# Altium schematic sheet Relays.SchDoc: RELAY
size A1; DocumentNumber: 5; SheetNumber: 5; SheetTotal: 5
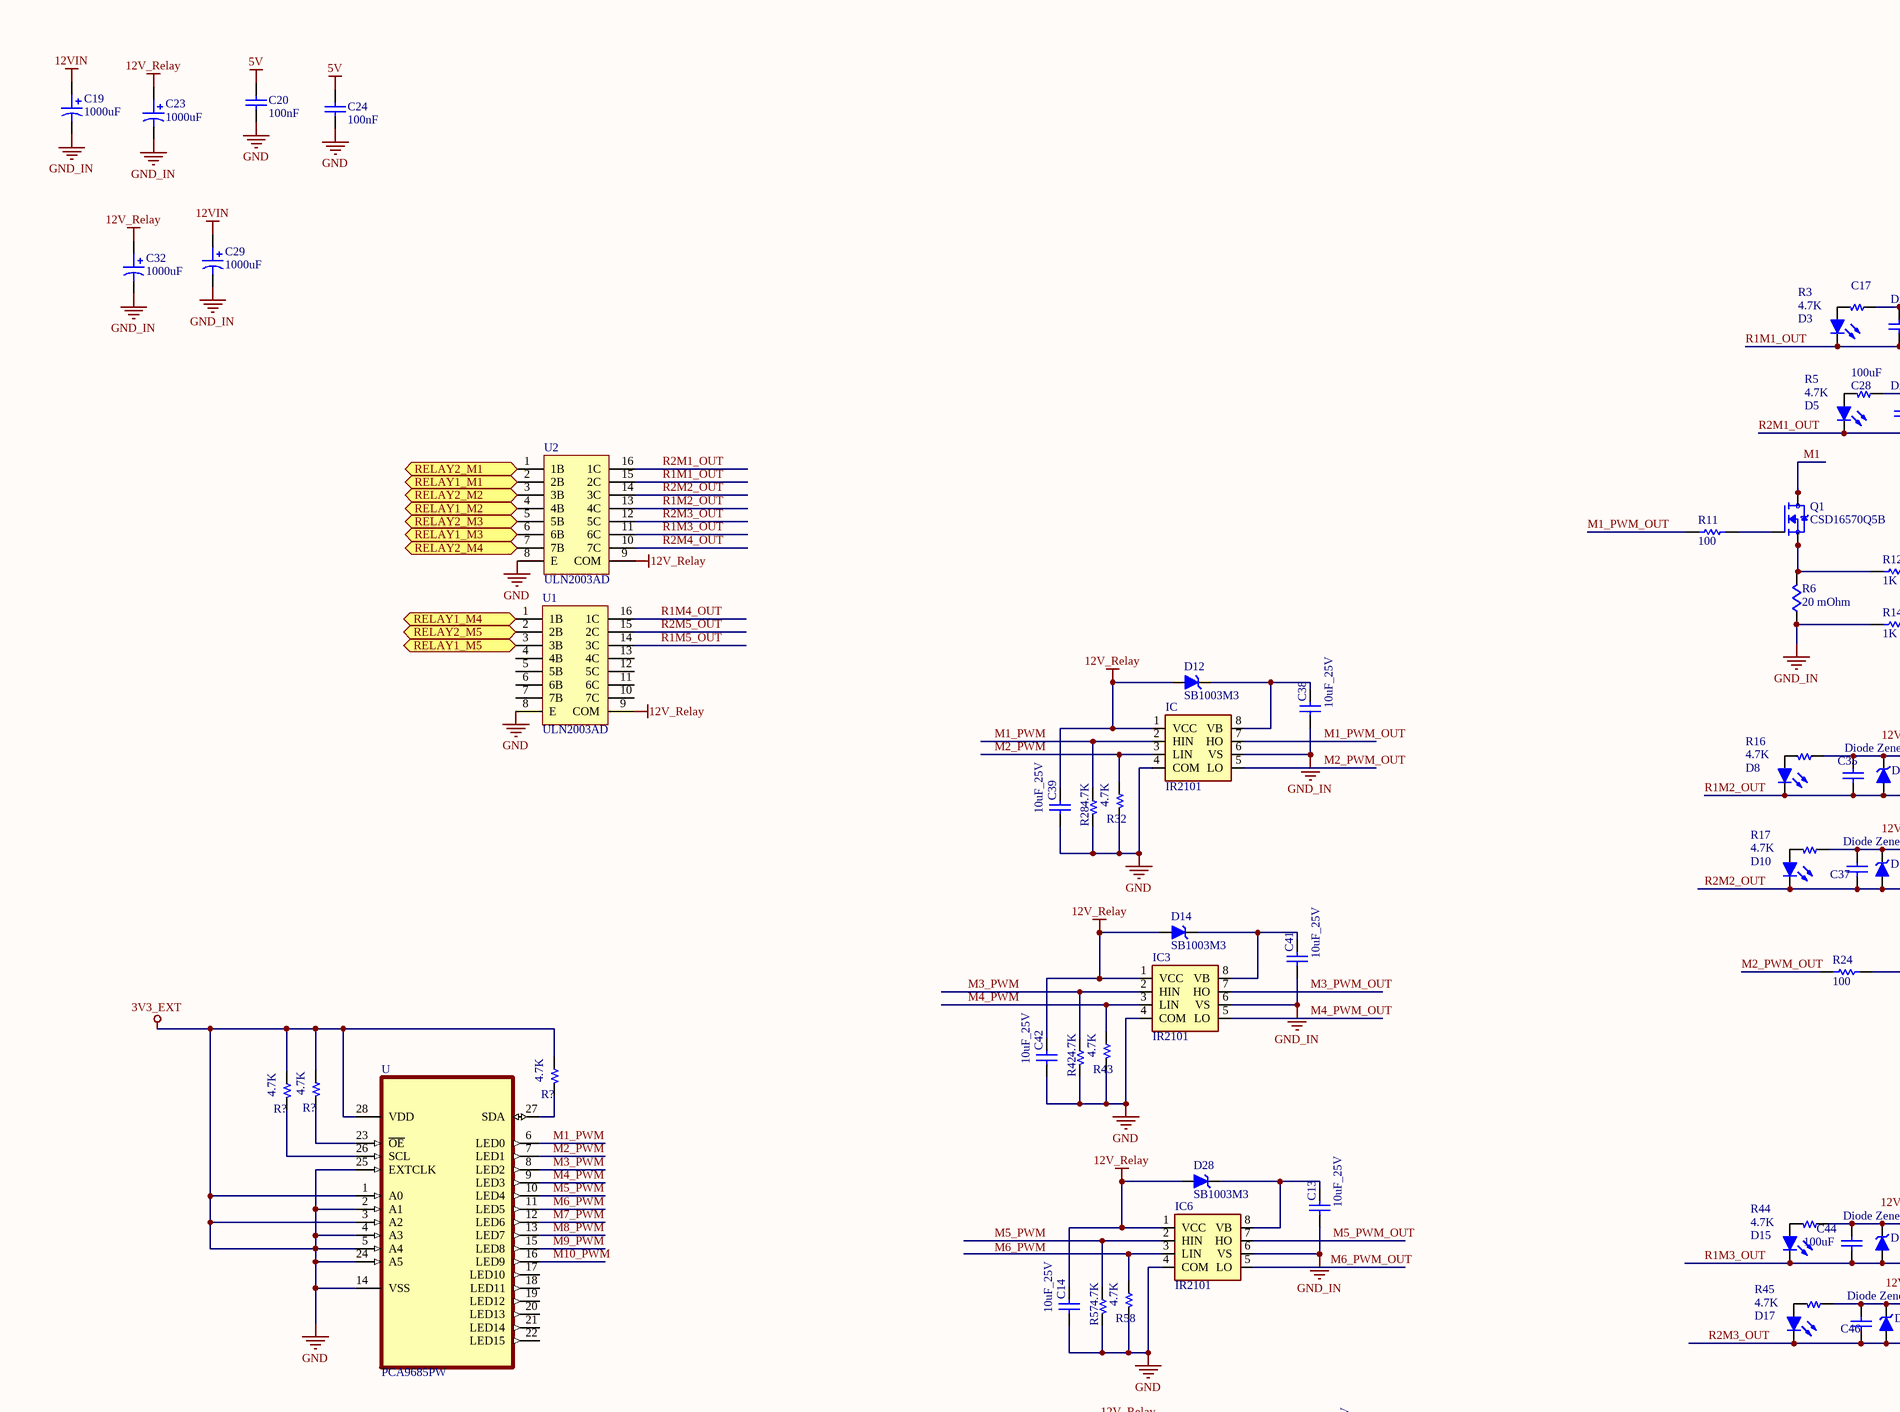
[diagram p0: Relays.SchDoc, top left]
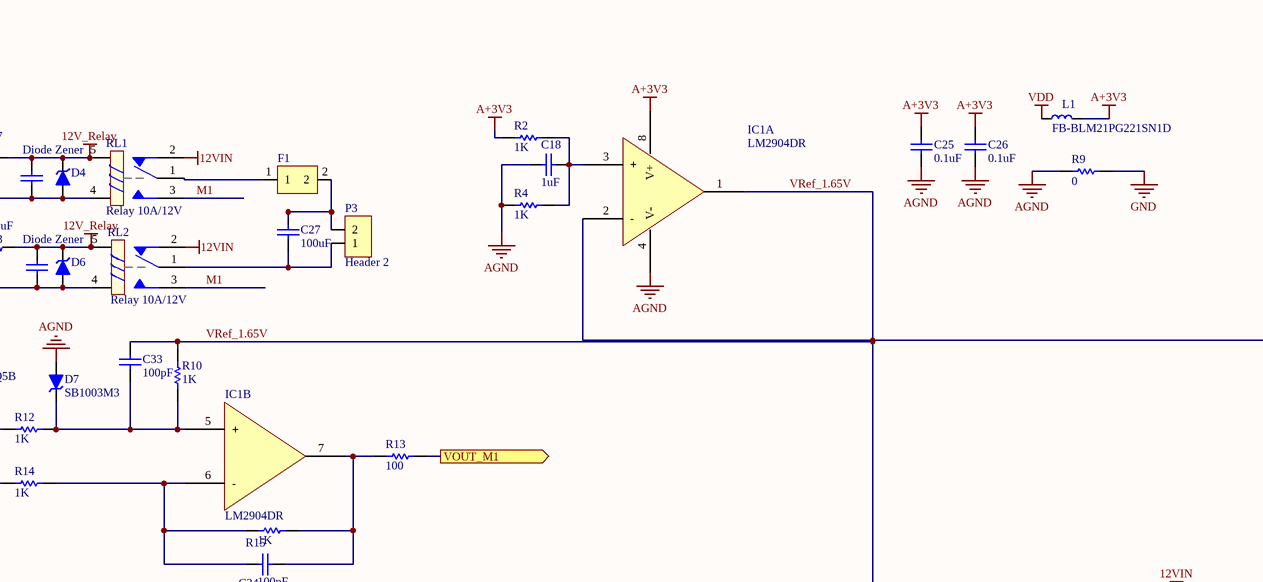
[diagram p1: Relays.SchDoc, top right]
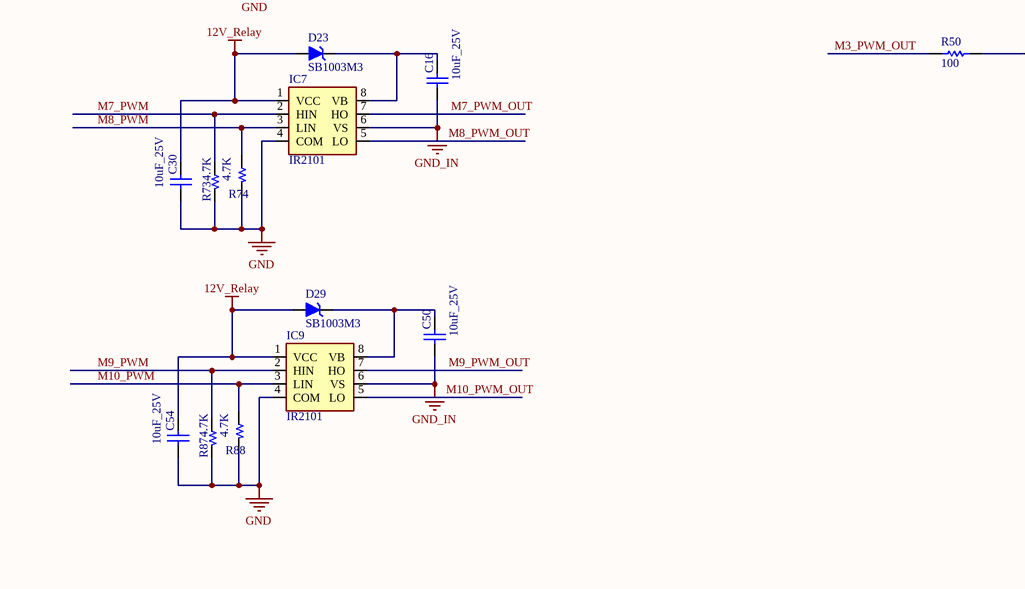
[diagram p2: Relays.SchDoc, bottom left]
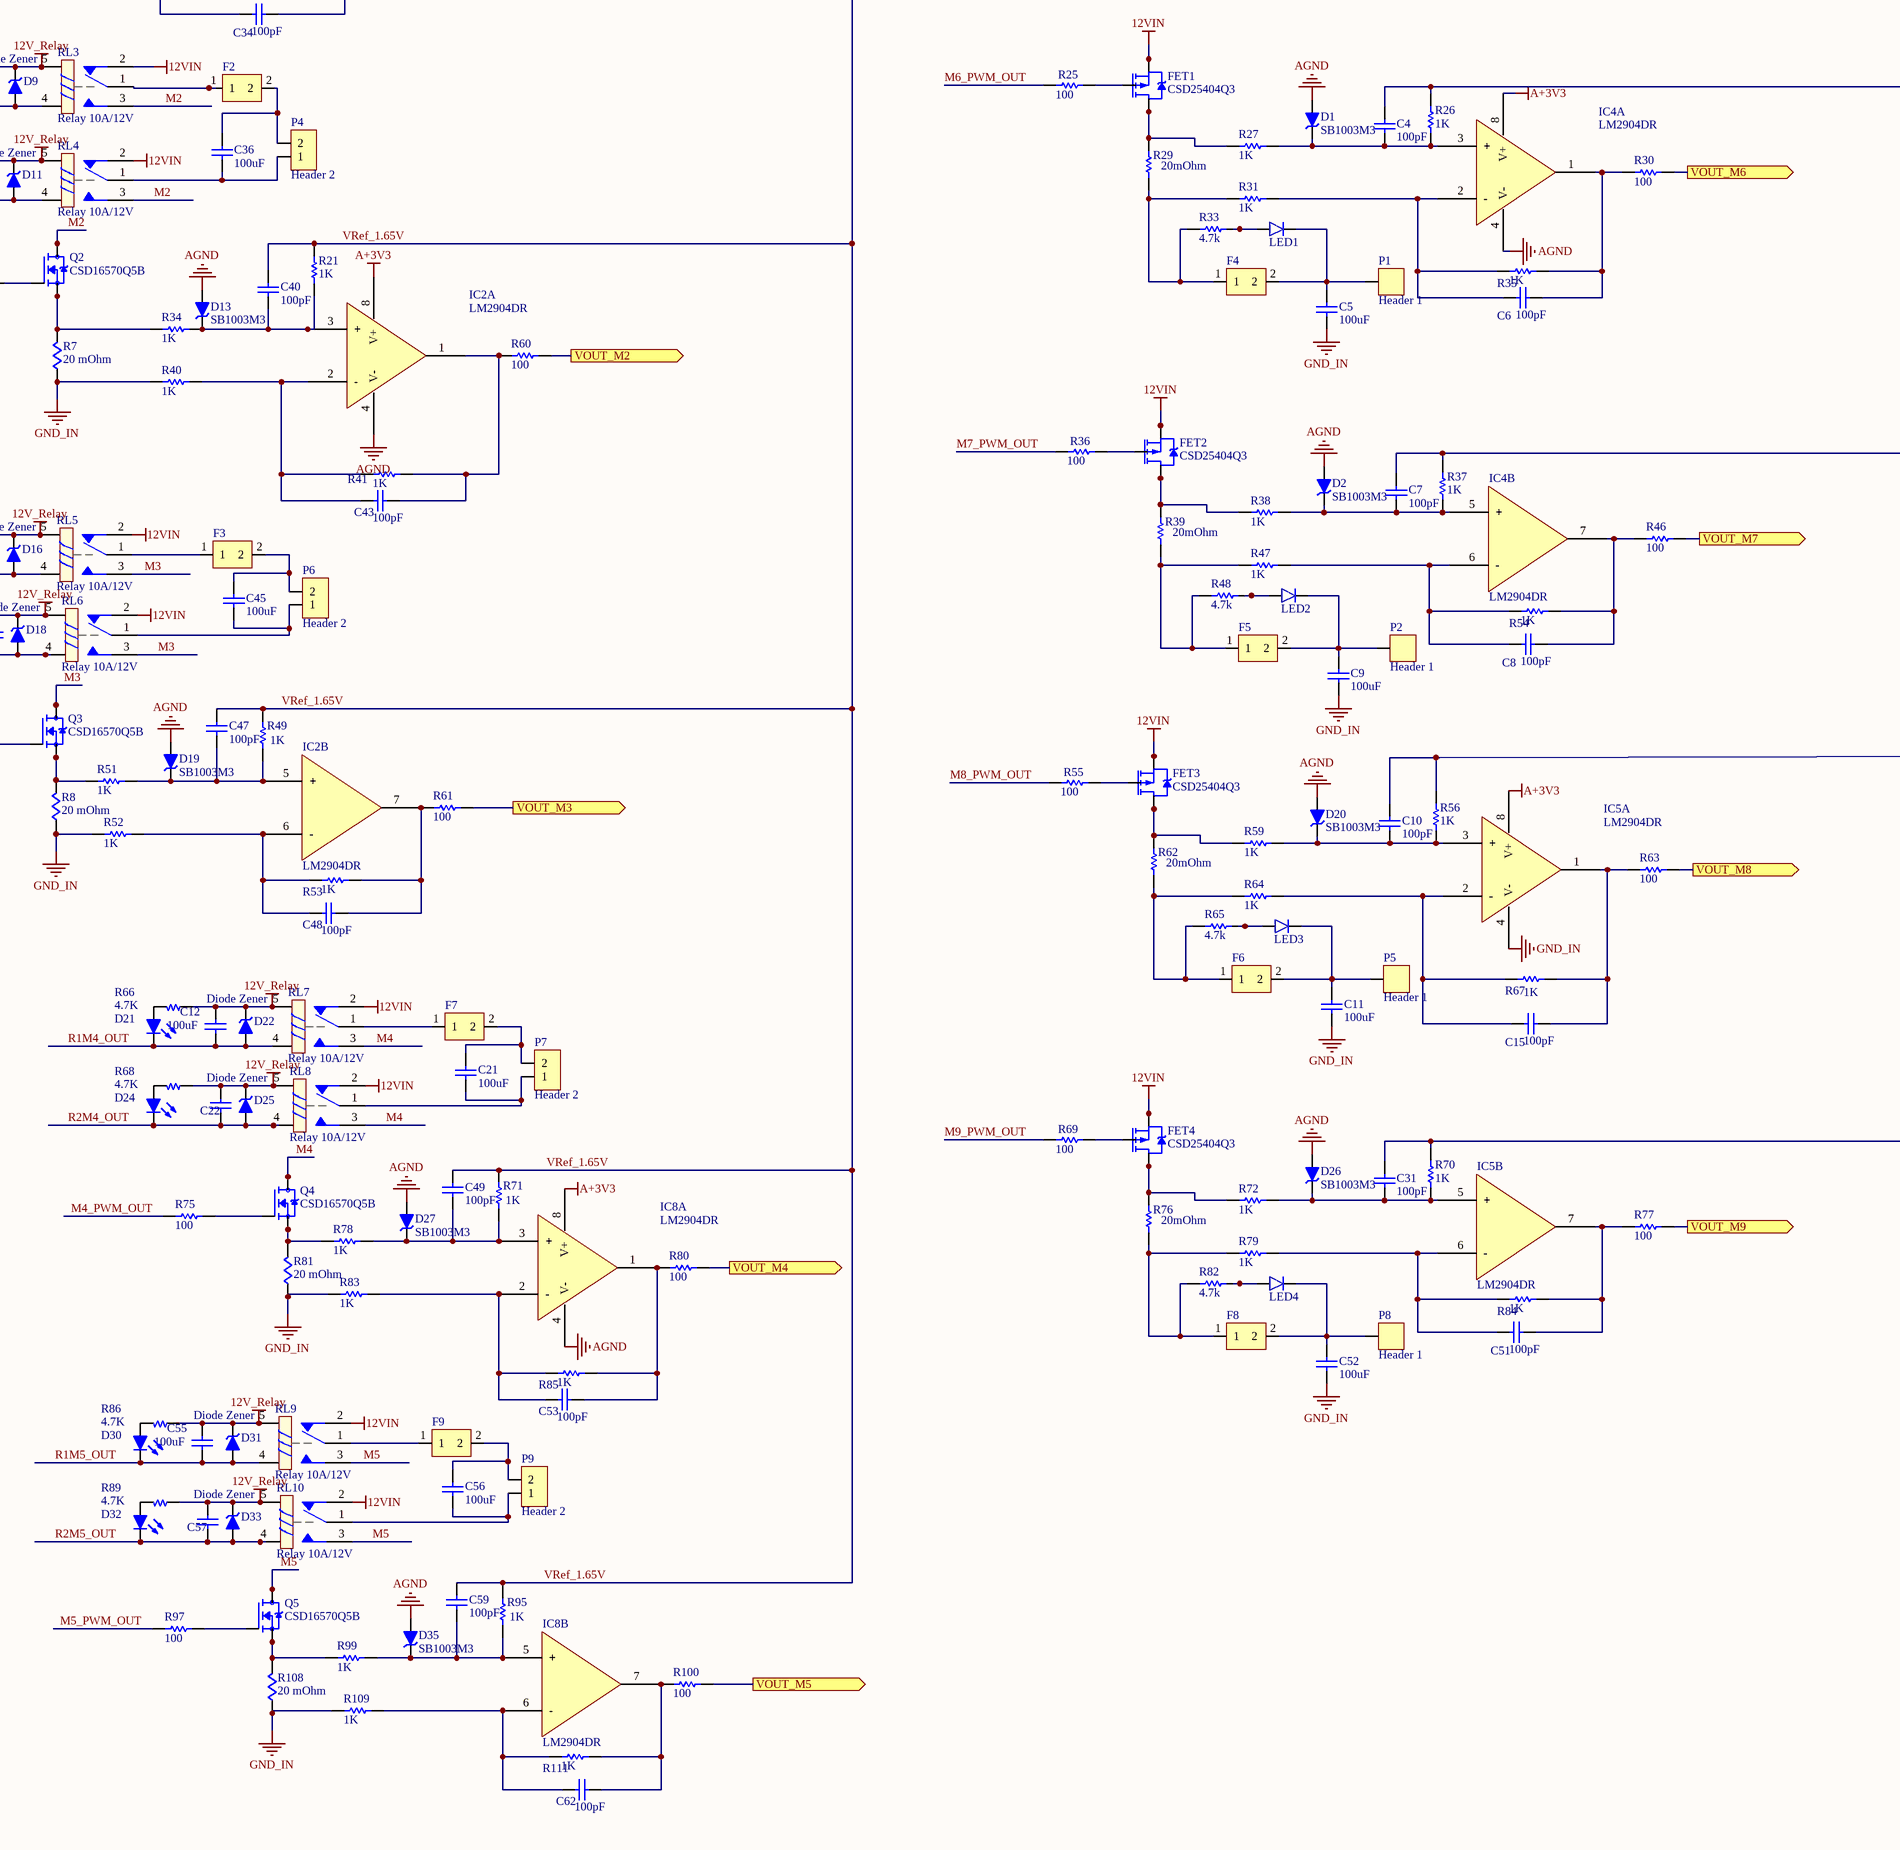
[diagram p3: Relays.SchDoc, bottom right]

## Parts
(Parts that share a designator on the sheet are numbered #1, #2 ... from top to bottom, then left to right.)
C4  value 100pF  [C 0805]  (hidden comment: Cap Non-pol)
C5  value 100uF  [CAP Ceramic/W200]  (hidden comment: Cap Non-pol)
C6  value 100pF  [C 0805]  (hidden comment: Cap Non-pol)
C7  value 100pF  [C 0805]  (hidden comment: Cap Non-pol)
C8  value 100pF  [C 0805]  (hidden comment: Cap Non-pol)
C9  value 100uF  [CAP Ceramic/W200]  (hidden comment: Cap Non-pol)
C10  value 100pF  [C 0805]  (hidden comment: Cap Non-pol)
C11  value 100uF  [CAP Ceramic/W200]  (hidden comment: Cap Non-pol)
C12  value 100uF  [C 0805]  (hidden comment: Cap Non-pol)
C13  10uF_25V  [C 0805]
C14  10uF_25V  [C 0805]
C15  value 100pF  [C 0805]  (hidden comment: Cap Non-pol)
C16  10uF_25V  [C 0805]
C17  Cap Non-pol  [C 0805]  (value not drawn)
C18  value 1uF  [C 0805]  (hidden comment: Cap Non-pol)
C19  value 1000uF  [CAP/D100/H200/LS50]  (hidden comment: Cap Pol)
C20  value 100nF  [C 0805]  (hidden comment: Cap Non-pol)
C21  value 100uF  [CAP Ceramic/W200]  (hidden comment: Cap Non-pol)
C22  Cap Non-pol  [C 0805]  (value not drawn)
C23  value 1000uF  [CAP/D100/H200/LS50]  (hidden comment: Cap Pol)
C24  value 100nF  [C 0805]  (hidden comment: Cap Non-pol)
C25  value 0.1uF  [C 0805]  (hidden comment: Cap Non-pol)
C26  value 0.1uF  [C 0805]  (hidden comment: Cap Non-pol)
C27  value 100uF  [CAP Ceramic/W200]  (hidden comment: Cap Non-pol)
C28  value 100uF  [C 0805]  (hidden comment: Cap Non-pol)
C29  value 1000uF  [CAP/D100/H200/LS50]  (hidden comment: Cap Pol)
C30  10uF_25V  [C 0805]
C31  value 100pF  [C 0805]  (hidden comment: Cap Non-pol)
C32  value 1000uF  [CAP/D100/H200/LS50]  (hidden comment: Cap Pol)
C33  value 100pF  [C 0805]  (hidden comment: Cap Non-pol)
C34  value 100pF  [C 0805]  (hidden comment: Cap Non-pol)
C35  Cap Non-pol  [C 0805]  (value not drawn)
C36  value 100uF  [CAP Ceramic/W200]  (hidden comment: Cap Non-pol)
C37  Cap Non-pol  [C 0805]  (value not drawn)
C38  10uF_25V  [C 0805]
C39  10uF_25V  [C 0805]
C40  value 100pF  [C 0805]  (hidden comment: Cap Non-pol)
C41  10uF_25V  [C 0805]
C42  10uF_25V  [C 0805]
C43  value 100pF  [C 0805]  (hidden comment: Cap Non-pol)
C44  value 100uF  [C 0805]  (hidden comment: Cap Non-pol)
C45  value 100uF  [CAP Ceramic/W200]  (hidden comment: Cap Non-pol)
C46  Cap Non-pol  [C 0805]  (value not drawn)
C47  value 100pF  [C 0805]  (hidden comment: Cap Non-pol)
C48  value 100pF  [C 0805]  (hidden comment: Cap Non-pol)
C49  value 100pF  [C 0805]  (hidden comment: Cap Non-pol)
C50  10uF_25V  [C 0805]
C51  value 100pF  [C 0805]  (hidden comment: Cap Non-pol)
C52  value 100uF  [CAP Ceramic/W200]  (hidden comment: Cap Non-pol)
C53  value 100pF  [C 0805]  (hidden comment: Cap Non-pol)
C54  10uF_25V  [C 0805]
C55  value 100uF  [C 0805]  (hidden comment: Cap Non-pol)
C56  value 100uF  [CAP Ceramic/W200]  (hidden comment: Cap Non-pol)
C57  Cap Non-pol  [C 0805]  (value not drawn)
C59  value 100pF  [C 0805]  (hidden comment: Cap Non-pol)
C62  value 100pF  [C 0805]  (hidden comment: Cap Non-pol)
D1  SB1003M3  [DO-214AC (SMA)]
D2  SB1003M3  [DO-214AC (SMA)]
D3  Led  [Led 0805 RED]  (value not drawn)
D4  Diode Zener  [SOD80C Wave]
D5  Led  [Led 0805 RED]  (value not drawn)
D6  Diode Zener  [SOD80C Wave]
D7  SB1003M3  [DO-214AC (SMA)]
D8  Led  [Led 0805 RED]  (value not drawn)
D9  Diode Zener  [SOD80C Wave]
D10  Led  [Led 0805 RED]  (value not drawn)
D11  Diode Zener  [SOD80C Wave]
D12  SB1003M3  [DO-214AC (SMA)]
D13  SB1003M3  [DO-214AC (SMA)]
D14  SB1003M3  [DO-214AC (SMA)]
D15  Led  [Led 0805 RED]  (value not drawn)
D16  Diode Zener  [SOD80C Wave]
D17  Led  [Led 0805 RED]  (value not drawn)
D18  Diode Zener  [SOD80C Wave]
D19  SB1003M3  [DO-214AC (SMA)]
D20  SB1003M3  [DO-214AC (SMA)]
D21  Led  [Led 0805 RED]  (value not drawn)
D22  Diode Zener  [SOD80C Wave]
D23  SB1003M3  [DO-214AC (SMA)]
D24  Led  [Led 0805 RED]  (value not drawn)
D25  Diode Zener  [SOD80C Wave]
D26  SB1003M3  [DO-214AC (SMA)]
D27  SB1003M3  [DO-214AC (SMA)]
D28  SB1003M3  [DO-214AC (SMA)]
D29  SB1003M3  [DO-214AC (SMA)]
D30  Led  [Led 0805 RED]  (value not drawn)
D31  Diode Zener  [SOD80C Wave]
D32  Led  [Led 0805 RED]  (value not drawn)
D33  Diode Zener  [SOD80C Wave]
D35  SB1003M3  [DO-214AC (SMA)]
F1  FUSE_DCAR_HOLDER  [DCAR Fuse holder]  (value not drawn)
F2  FUSE_DCAR_HOLDER  [DCAR Fuse holder]  (value not drawn)
F3  FUSE_DCAR_HOLDER  [DCAR Fuse holder]  (value not drawn)
F4  FUSE_DCAR_HOLDER  [DCAR Fuse holder]  (value not drawn)
F5  FUSE_DCAR_HOLDER  [DCAR Fuse holder]  (value not drawn)
F6  FUSE_DCAR_HOLDER  [DCAR Fuse holder]  (value not drawn)
F7  FUSE_DCAR_HOLDER  [DCAR Fuse holder]  (value not drawn)
F8  FUSE_DCAR_HOLDER  [DCAR Fuse holder]  (value not drawn)
F9  FUSE_DCAR_HOLDER  [DCAR Fuse holder]  (value not drawn)
FET1  CSD25404Q3  [*SON65P300X315X90-9N]
FET2  CSD25404Q3  [*SON65P300X315X90-9N]
FET3  CSD25404Q3  [*SON65P300X315X90-9N]
FET4  CSD25404Q3  [*SON65P300X315X90-9N]
IC  IR2101  [SOIC-8-I/SN]
IC1  LM2904DR  [SOIC-8-I/SN]  (parts A,B of 2)
IC2  LM2904DR  [SOIC-8-I/SN]  (parts A,B of 2)
IC3  IR2101  [SOIC-8-I/SN]
IC4  LM2904DR  [SOIC-8-I/SN]  (parts A,B of 2)
IC5  LM2904DR  [SOIC-8-I/SN]  (parts A,B of 2)
IC6  IR2101  [SOIC-8-I/SN]
IC7  IR2101  [SOIC-8-I/SN]
IC8  LM2904DR  [SOIC-8-I/SN]  (parts A,B of 2)
IC9  IR2101  [SOIC-8-I/SN]
L1  FB-BLM21PG221SN1D  [L 0805 (2012)]
LED1  Led  [Led SMD 0805]  (value not drawn)
LED2  Led  [Led SMD 0805]  (value not drawn)
LED3  Led  [Led SMD 0805]  (value not drawn)
LED4  Led  [Led SMD 0805]  (value not drawn)
P1  Header 1  [Head1_DCar]
P2  Header 1  [Head1_DCar]
P3  Header 2  [HDR Domino 2]
P4  Header 2  [HDR Domino 2]
P5  Header 1  [Head1_DCar]
P6  Header 2  [HDR Domino 2]
P7  Header 2  [HDR Domino 2]
P8  Header 1  [Head1_DCar]
P9  Header 2  [HDR Domino 2]
Q1  CSD16570Q5B  [TRANS_CSD19502Q5BT]
Q2  CSD16570Q5B  [TRANS_CSD19502Q5BT]
Q3  CSD16570Q5B  [TRANS_CSD19502Q5BT]
Q4  CSD16570Q5B  [TRANS_CSD19502Q5BT]
Q5  CSD16570Q5B  [TRANS_CSD19502Q5BT]
R2  1K  [R 0805]
R3  4.7K  [R 0805]
R4  1K  [R 0805]
R5  4.7K  [R 0805]
R6  value 20 mOhm  [R2512]  (hidden comment: Resistor2)
R7  value 20 mOhm  [R2512]  (hidden comment: Resistor2)
R8  value 20 mOhm  [R2512]  (hidden comment: Resistor2)
R9  0  [R 0805]
R10  1K  [R 0805]
R11  100  [R 0805]
R12  1K  [R 0805]
R13  100  [R 0805]
R14  1K  [R 0805]
R15  1K  [R 0805]
R16  4.7K  [R 0805]
R17  4.7K  [R 0805]
R21  1K  [R 0805]
R24  100  [R 0805]
R25  100  [R 0805]
R26  1K  [R 0805]
R27  1K  [R 0805]
R28  4.7K  [R 0805]
R29  20mOhm  [R 2512 (6432)]
R30  100  [R 0805]
R31  1K  [R 0805]
R32  4.7K  [R 0805]
R33  4.7k  [R 0805 (2012)]
R34  1K  [R 0805]
R35  1K  [R 0805]
R36  100  [R 0805]
R37  1K  [R 0805]
R38  1K  [R 0805]
R39  20mOhm  [R 2512 (6432)]
R40  1K  [R 0805]
R41  1K  [R 0805]
R42  4.7K  [R 0805]
R43  4.7K  [R 0805]
R44  4.7K  [R 0805]
R45  4.7K  [R 0805]
R46  100  [R 0805]
R47  1K  [R 0805]
R48  4.7k  [R 0805 (2012)]
R49  1K  [R 0805]
R50  100  [R 0805]
R51  1K  [R 0805]
R52  1K  [R 0805]
R53  1K  [R 0805]
R54  1K  [R 0805]
R55  100  [R 0805]
R56  1K  [R 0805]
R57  4.7K  [R 0805]
R58  4.7K  [R 0805]
R59  1K  [R 0805]
R60  100  [R 0805]
R61  100  [R 0805]
R62  20mOhm  [R 2512 (6432)]
R63  100  [R 0805]
R64  1K  [R 0805]
R65  4.7k  [R 0805 (2012)]
R66  4.7K  [R 0805]
R67  1K  [R 0805]
R68  4.7K  [R 0805]
R69  100  [R 0805]
R70  1K  [R 0805]
R71  1K  [R 0805]
R72  1K  [R 0805]
R73  4.7K  [R 0805]
R74  4.7K  [R 0805]
R75  100  [R 0805]
R76  20mOhm  [R 2512 (6432)]
R77  100  [R 0805]
R78  1K  [R 0805]
R79  1K  [R 0805]
R80  100  [R 0805]
R81  value 20 mOhm  [R2512]  (hidden comment: Resistor2)
R82  4.7k  [R 0805 (2012)]
R83  1K  [R 0805]
R84  1K  [R 0805]
R85  1K  [R 0805]
R86  4.7K  [R 0805]
R87  4.7K  [R 0805]
R88  4.7K  [R 0805]
R89  4.7K  [R 0805]
R95  1K  [R 0805]
R97  100  [R 0805]
R99  1K  [R 0805]
R100  100  [R 0805]
R108  value 20 mOhm  [R2512]  (hidden comment: Resistor2)
R109  1K  [R 0805]
R111  1K  [R 0805]
R?#1  4.7K  [R 0805]
R?#2  4.7K  [R 0805]
R?#3  4.7K  [R 0805]
RL1  Relay 10A/12V  [RL_SPDT_20A_SMALL]
RL2  Relay 10A/12V  [RL_SPDT_20A_SMALL]
RL3  Relay 10A/12V  [RL_SPDT_20A_SMALL]
RL4  Relay 10A/12V  [RL_SPDT_20A_SMALL]
RL5  Relay 10A/12V  [RL_SPDT_20A_SMALL]
RL6  Relay 10A/12V  [RL_SPDT_20A_SMALL]
RL7  Relay 10A/12V  [RL_SPDT_20A_SMALL]
RL8  Relay 10A/12V  [RL_SPDT_20A_SMALL]
RL9  Relay 10A/12V  [RL_SPDT_20A_SMALL]
RL10  Relay 10A/12V  [RL_SPDT_20A_SMALL]
U  PCA9685PW  [SOP65P640X110-28N]
U1  ULN2003AD  [SOIC-16]
U2  ULN2003AD  [SOIC-16]

## Ports
RELAY1_M1 (in), RELAY1_M2 (in), RELAY1_M3 (in), RELAY1_M4 (in), RELAY1_M5 (in), RELAY2_M1 (in), RELAY2_M2 (in), RELAY2_M3 (in), RELAY2_M4 (in), RELAY2_M5 (in), VOUT_M1 (out), VOUT_M2 (out), VOUT_M3 (out), VOUT_M4 (out), VOUT_M5 (out), VOUT_M6 (out), VOUT_M7 (out), VOUT_M8 (out), VOUT_M9 (out)

## Nets
3V3_EXT: R?#1.1 R?#2.1 R?#3.1 U.1(A0) U.2(A1) U.3(A2) U.4(A3) U.5(A4) U.25(EXTCLK) U.28(VDD)
5V: C20.2 C24.2
12V_Relay: C12.2 C14.2 C17.2 C22.2 C23.1 C28.2 C30.2 C32.1 C35.2 C37.2 C39.2 C42.2 C44.2 C46.2 C54.2 C55.2 C57.2 D4.2(K) D6.2(K) D9.2(K) D11.2(K) D12.1(A) D14.1(A) D16.2(K) D18.2(K) D22.2(K) D23.1(A) D25.2(K) D28.1(A) D29.1(A) D31.2(K) D33.2(K) IC.1(VCC) IC3.1(VCC) IC6.1(VCC) IC7.1(VCC) IC9.1(VCC) R3.1 R5.1 R16.1 R17.1 R44.1 R45.1 R66.1 R68.1 R86.1 R89.1 RL1.5 RL2.5 RL3.5 RL4.5 RL5.5 RL6.5 RL7.5 RL8.5 RL9.5 RL10.5 U1.9(COM) U2.9(COM)
12VIN: C19.1 C29.1 FET1.1(D) FET1.2(D) FET1.3(D) FET2.1(D) FET2.2(D) FET2.3(D) FET3.1(D) FET3.2(D) FET3.3(D) FET4.1(D) FET4.2(D) FET4.3(D) RL1.2 RL2.2 RL3.2 RL4.2 RL5.2 RL6.2 RL7.2 RL8.2 RL9.2 RL10.2
A+3V3: C25.2 C26.2 IC1.8(V+) IC2.8(V+) IC4.8(V+) IC5.8(V+) IC8.8(V+) L1.2 R2.1
AGND: C18.2 C25.1 C26.1 D1.1(A) D2.1(A) D7.1(A) D13.1(A) D19.1(A) D20.1(A) D26.1(A) D27.1(A) D35.1(A) IC1.4(V-) IC2.4(V-) IC4.4(V-) IC8.4(V-) R4.1 R9.1
GND: C14.1 C20.1 C24.1 C30.1 C39.1 C42.1 C54.1 IC.4(COM) IC3.4(COM) IC6.4(COM) IC7.4(COM) IC9.4(COM) R9.2 R28.2 R32.2 R42.2 R43.2 R57.2 R58.2 R73.2 R74.2 R87.2 R88.2 U.14(VSS) U.24(A5) U1.8(E) U2.8(E)
GND_IN: C5.1 C9.1 C11.1 C13.1 C16.1 C19.2 C23.2 C29.2 C32.2 C38.1 C41.1 C50.1 C52.1 IC.6(VS) IC3.6(VS) IC5.4(V-) IC6.6(VS) IC7.6(VS) IC9.6(VS) R6.1 R7.1 R8.1 R14.2 R40.2 R52.2 R81.1 R83.2 R108.1 R109.2
VDD: L1.1
M1: Q1.9(D) Q1.9_1(D) Q1.9_2(D) Q1.9_3(D) Q1.9_4(D) Q1.9_5(D) Q1.9_6(D) Q1.9_7(D) RL1.3 RL2.3
M1_PWM: IC.2(HIN) R28.1 U.6(LED0)
M1_PWM_OUT: IC.7(HO) R11.2
M2: Q2.9(D) Q2.9_1(D) Q2.9_2(D) Q2.9_3(D) Q2.9_4(D) Q2.9_5(D) Q2.9_6(D) Q2.9_7(D) RL3.3 RL4.3
M2_PWM: IC.3(LIN) R32.1 U.7(LED1)
M2_PWM_OUT: IC.5(LO) R24.2
M3: Q3.9(D) Q3.9_1(D) Q3.9_2(D) Q3.9_3(D) Q3.9_4(D) Q3.9_5(D) Q3.9_6(D) Q3.9_7(D) RL5.3 RL6.3
M3_PWM: IC3.2(HIN) R42.1 U.8(LED2)
M3_PWM_OUT: IC3.7(HO) R50.2
M4: Q4.9(D) Q4.9_1(D) Q4.9_2(D) Q4.9_3(D) Q4.9_4(D) Q4.9_5(D) Q4.9_6(D) Q4.9_7(D) RL7.3 RL8.3
M4_PWM: IC3.3(LIN) R43.1 U.9(LED3)
M4_PWM_OUT: IC3.5(LO) R75.2
M5: Q5.9(D) Q5.9_1(D) Q5.9_2(D) Q5.9_3(D) Q5.9_4(D) Q5.9_5(D) Q5.9_6(D) Q5.9_7(D) RL9.3 RL10.3
M5_PWM: IC6.2(HIN) R57.1 U.10(LED4)
M5_PWM_OUT: IC6.7(HO) R97.2
M6_PWM: U.11(LED5)
M6_PWM_OUT: IC6.5(LO) R25.2
M7_PWM: IC7.2(HIN) R73.1 U.12(LED6)
M7_PWM_OUT: IC7.7(HO) R36.2
M8_PWM: IC7.3(LIN) R74.1 U.13(LED7)
M8_PWM_OUT: IC7.5(LO) R55.2
M9_PWM: IC9.2(HIN) R87.1 U.15(LED8)
M9_PWM_OUT: IC9.7(HO) R69.2
M10_PWM: IC9.3(LIN) R88.1 U.16(LED9)
M10_PWM_OUT: IC9.5(LO)
R1M1_OUT: C17.1 D3.2(K) D4.1(A) RL1.4 U2.15(2C)
R1M2_OUT: C35.1 D8.2(K) D9.1(A) RL3.4 U2.13(4C)
R1M3_OUT: C44.1 D15.2(K) D16.1(A) RL5.4 U2.11(6C)
R1M4_OUT: C12.1 D21.2(K) D22.1(A) RL7.4 U1.16(1C)
R1M5_OUT: C55.1 D30.2(K) D31.1(A) RL9.4 U1.14(3C)
R2M1_OUT: C28.1 D5.2(K) D6.1(A) RL2.4 U2.16(1C)
R2M2_OUT: C37.1 D10.2(K) D11.1(A) RL4.4 U2.14(3C)
R2M3_OUT: C46.1 D17.2(K) D18.1(A) RL6.4 U2.12(5C)
R2M4_OUT: C22.1 D24.2(K) D25.1(A) RL8.4 U2.10(7C)
R2M5_OUT: C57.1 D32.2(K) D33.1(A) RL10.4 U1.15(2C)
RELAY1_M1: U2.2(2B) ; port RELAY1_M1
RELAY1_M2: U2.4(4B) ; port RELAY1_M2
RELAY1_M3: U2.6(6B) ; port RELAY1_M3
RELAY1_M4: U1.1(1B) ; port RELAY1_M4
RELAY1_M5: U1.3(3B) ; port RELAY1_M5
RELAY2_M1: U2.1(1B) ; port RELAY2_M1
RELAY2_M2: U2.3(3B) ; port RELAY2_M2
RELAY2_M3: U2.5(5B) ; port RELAY2_M3
RELAY2_M4: U2.7(7B) ; port RELAY2_M4
RELAY2_M5: U1.2(2B) ; port RELAY2_M5
VOUT_M1: R13.1 ; port VOUT_M1
VOUT_M2: R60.1 ; port VOUT_M2
VOUT_M3: R61.1 ; port VOUT_M3
VOUT_M4: R80.1 ; port VOUT_M4
VOUT_M5: R100.1 ; port VOUT_M5
VOUT_M6: R30.1 ; port VOUT_M6
VOUT_M7: R46.1 ; port VOUT_M7
VOUT_M8: R63.1 ; port VOUT_M8
VOUT_M9: R77.1 ; port VOUT_M9
VRef_1.65V: C4.1 C7.1 C10.1 C31.1 C33.1 C40.1 C47.1 C49.1 C59.1 IC1.1(OUTA) IC1.2(-) R10.1 R21.1 R26.1 R37.1 R49.1 R56.1 R70.1 R71.1 R95.1
NetC4_2: C4.2 D1.2(K) IC4.3(+) R26.2 R27.1
NetC5_2: C5.2 F4.2 LED1.2(K) P1.1
NetC6_1: C6.1 IC4.1(OUTA) R30.2 R35.1
NetC6_2: C6.2 IC4.2(-) R31.1 R35.2
NetC7_2: C7.2 D2.2(K) IC4.5(+) R37.2 R38.1
NetC8_1: C8.1 IC4.7(OUTB) R46.2 R54.1
NetC8_2: C8.2 IC4.6(-) R47.1 R54.2
NetC9_2: C9.2 F5.2 LED2.2(K) P2.1
NetC10_2: C10.2 D20.2(K) IC5.3(+) R56.2 R59.1
NetC11_2: C11.2 F6.2 LED3.2(K) P5.1
NetC13_2: C13.2 D28.2(K) IC6.8(VB)
NetC15_1: C15.1 IC5.1(OUTA) R63.2 R67.1
NetC15_2: C15.2 IC5.2(-) R64.1 R67.2
NetC16_2: C16.2 D23.2(K) IC7.8(VB)
NetC18_1: C18.1 IC1.3(+) R2.2 R4.2
NetC21_1: C21.1 P7.1 RL8.1
NetC21_2: C21.2 F7.2 P7.2
NetC27_1: C27.1 P3.1 RL2.1
NetC27_2: C27.2 F1.2 P3.2
NetC31_2: C31.2 D26.2(K) IC5.5(+) R70.2 R72.1
NetC33_2: C33.2 D7.2(K) IC1.5(+) R10.2 R12.1
NetC34_1: C34.1 IC1.7(OUTB) R13.2 R15.1
NetC34_2: C34.2 IC1.6(-) R14.1 R15.2
NetC36_1: C36.1 P4.1 RL4.1
NetC36_2: C36.2 F2.2 P4.2
NetC38_2: C38.2 D12.2(K) IC.8(VB)
NetC40_2: C40.2 D13.2(K) IC2.3(+) R21.2 R34.1
NetC41_2: C41.2 D14.2(K) IC3.8(VB)
NetC43_1: C43.1 IC2.1(OUTA) R41.1 R60.2
NetC43_2: C43.2 IC2.2(-) R40.1 R41.2
NetC45_1: C45.1 P6.1 RL6.1
NetC45_2: C45.2 F3.2 P6.2
NetC47_2: C47.2 D19.2(K) IC2.5(+) R49.2 R51.1
NetC48_1: C48.1 IC2.7(OUTB) R53.1 R61.2
NetC48_2: C48.2 IC2.6(-) R52.1 R53.2
NetC49_2: C49.2 D27.2(K) IC8.3(+) R71.2 R78.1
NetC50_2: C50.2 D29.2(K) IC9.8(VB)
NetC51_1: C51.1 IC5.7(OUTB) R77.2 R84.1
NetC51_2: C51.2 IC5.6(-) R79.1 R84.2
NetC52_2: C52.2 F8.2 LED4.2(K) P8.1
NetC53_1: C53.1 IC8.1(OUTA) R80.2 R85.1
NetC53_2: C53.2 IC8.2(-) R83.1 R85.2
NetC56_1: C56.1 P9.1 RL10.1
NetC56_2: C56.2 F9.2 P9.2
NetC59_2: C59.2 D35.2(K) IC8.5(+) R95.2 R99.1
NetC62_1: C62.1 IC8.7(OUTB) R100.2 R111.1
NetC62_2: C62.2 IC8.6(-) R109.1 R111.2
NetD3_1: D3.1(A) R3.2
NetD5_1: D5.1(A) R5.2
NetD8_1: D8.1(A) R16.2
NetD10_1: D10.1(A) R17.2
NetD15_1: D15.1(A) R44.2
NetD17_1: D17.1(A) R45.2
NetD21_1: D21.1(A) R66.2
NetD24_1: D24.1(A) R68.2
NetD30_1: D30.1(A) R86.2
NetD32_1: D32.1(A) R89.2
NetF1_1: F1.1 RL1.1
NetF2_1: F2.1 RL3.1
NetF3_1: F3.1 RL5.1
NetF4_1: F4.1 R29.1 R31.2 R33.1
NetF5_1: F5.1 R39.1 R47.2 R48.1
NetF6_1: F6.1 R62.1 R64.2 R65.1
NetF7_1: F7.1 RL7.1
NetF8_1: F8.1 R76.1 R79.2 R82.1
NetF9_1: F9.1 RL9.1
NetFET1_4: FET1.4(G) R25.1
NetFET1_5-9: FET1.5-9(S) FET1.P$6(S) FET1.P$7(S) FET1.P$8(S) FET1.P$9(S) FET1.P$10(S) FET1.P$11(S) FET1.P$12(S) R27.2 R29.2
NetFET2_4: FET2.4(G) R36.1
NetFET2_5-9: FET2.5-9(S) FET2.P$6(S) FET2.P$7(S) FET2.P$8(S) FET2.P$9(S) FET2.P$10(S) FET2.P$11(S) FET2.P$12(S) R38.2 R39.2
NetFET3_4: FET3.4(G) R55.1
NetFET3_5-9: FET3.5-9(S) FET3.P$6(S) FET3.P$7(S) FET3.P$8(S) FET3.P$9(S) FET3.P$10(S) FET3.P$11(S) FET3.P$12(S) R59.2 R62.2
NetFET4_4: FET4.4(G) R69.1
NetFET4_5-9: FET4.5-9(S) FET4.P$6(S) FET4.P$7(S) FET4.P$8(S) FET4.P$9(S) FET4.P$10(S) FET4.P$11(S) FET4.P$12(S) R72.2 R76.2
NetIC6_3: IC6.3(LIN) R58.1
NetLED1_1: LED1.1(A) R33.2
NetLED2_1: LED2.1(A) R48.2
NetLED3_1: LED3.1(A) R65.2
NetLED4_1: LED4.1(A) R82.2
NetQ1_1: Q1.1(S) Q1.2(S) Q1.3(S) R6.2 R12.2
NetQ1_4: Q1.4(G) R11.1
NetQ2_1: Q2.1(S) Q2.2(S) Q2.3(S) R7.2 R34.2
NetQ2_4: Q2.4(G) R24.1
NetQ3_1: Q3.1(S) Q3.2(S) Q3.3(S) R8.2 R51.2
NetQ3_4: Q3.4(G) R50.1
NetQ4_1: Q4.1(S) Q4.2(S) Q4.3(S) R78.2 R81.2
NetQ4_4: Q4.4(G) R75.1
NetQ5_1: Q5.1(S) Q5.2(S) Q5.3(S) R99.2 R108.2
NetQ5_4: Q5.4(G) R97.1
NetR?#1_2: R?#1.2 U.27(SDA)
NetR?#2_2: R?#2.2 U.26(SCL)
NetR?#3_2: R?#3.2 U.23(~{OE})

Not connected (* = marked no-connect by the designer): U 17(LED10) 18(LED11) 19(LED12) 20(LED13) 21(LED14) 22(LED15); U1 4(4B) 5(5B) 6(6B) 7(7B) 10(7C) 11(6C) 12(5C) 13(4C)

## Notes on the sheet
- Labels drawn without touching a wire or pin: M6_PWM
- Title
- Size:
- Date:
- File:
- A4
- Number:
- Time:
- Revision:
- Sheet
- of
- NPN
- Lab

## Library data of the parts
C4-C18 C20-C22 C24-C28 C30 C31 C33-C57 C59 C62 = Cap Non-pol: Non-polarized Capacitor; Published: 8-Jun-2000; LatestRevisionDate: 17-Jul-2002; LatestRevisionNote: Re-released for DXP Platform.; PackageReference: RAD-0.3; Publisher: Altium Limited
C19 C23 C29 C32 = Cap Pol: Polarized Capacitor; Published: 8-Jun-2000; LatestRevisionDate: 17-Jul-2002; LatestRevisionNote: Re-released for DXP Platform.; PackageReference: POLAR0.8; Publisher: Altium Limited
D1 D2 D4 D6 D7 D9 D11-D14 D16 D18-D20 D22 D23 D25-D29 D31 D33 D35 = Diode Zener: Zener Diode
  D4 D6 D9 D11 D16 D18 D22 D25 D31 D33: Published: 8-Jun-2000; LatestRevisionDate: 17-Jul-2002; LatestRevisionNote: Re-released for DXP Platform.; PackageReference: DIODE-0.7; Publisher: Altium Limited
D3 D5 D8 D10 D15 D17 D21 D24 D30 D32 = Led: LED RED CLEAR 0805 SMD; PACKAGE: SMD0805; STOCK CODE: HT17-2102SURC; SUPPLIER: tme.vn; TYPE: SMD; STOCK DESC: SMD-0805 High Bright Red Chip LED; UNIT PRICE: 800
IC IC3 IC6 IC7 IC9 = IR2101: Half-Bridge Gate Driver IC Non-Inverting 8-SOIC; MF: Infineon; Availability: Unavailable; Package: DIP-8 International Rectifier; MP: IR2101; SnapEDA_Link: https://www.snapeda.com/parts/IR2101/Infineon%20Technologies/view-part/41866/?ref=snap; Value: *; Price: None
IC1 IC2 IC4 IC5 IC8 = LM2904DR: IC OPAMP GP 2 CIRCUIT 8SOIC; Manufacturer: Texas Instruments; Amplifier Type: General Purpose; Current - Input Bias: 20nA; Current - Output / Channel: 30mA; Current - Supply: 1mA; Gain Bandwidth Product: 700kHz; Number of Circuits: 2; Slew Rate: 0.3V/µs; Voltage - Input Offset: 3mV; Voltage - Supply, Single/Dual (±): 3V ~ 26V, ±1.5V ~ 13V; Part Number: LM2904DR; ComponentLink1Description: Datasheet; ComponentLink1URL: http://www.ti.com/general/docs/suppproductinfo.tsp?distId=10&gotoUrl=http%3A%2F%2Fwww.ti.com%2Flit%2Fgpn%2Flm258a; ComponentLink2Description: DigiKey Link; ComponentLink2URL: http://digikey.com/product-detail/en/texas-instruments/LM2904DR/296-14596-1-ND/555533; Device Package: 8-SOIC (0.154", 3.90mm Width); LastUpdated: 1/9/2020 2:06:28 AM; Lifecycle Status: Active; Minimum Order: 1; Mounting Type: Surface Mount; Operating Temperature: -40°C ~ 125°C; Package / Case: 8-SOIC (0.154", 3.90mm Width); Packaging: ReReel; PartId: 4; Part Status: Active; Price: 0.00; Series: -; Supplier 1: DigiKey; Supplier Part Number 1: 296-14596-1-ND; Supplier Device Package: 8-SOIC
L1 = Inductor
LED1-LED4 = Led: Typical LED
P1 P2 P5 P8 = Header 1: Header, 1-Pin; LatestRevisionDate: 17-Jul-2002; LatestRevisionNote: Re-released for DXP Platform.; Publisher: Altium Limited
P3 P4 P6 P7 P9 = Header 2: Header, 2-Pin; LatestRevisionDate: 17-Jul-2002; LatestRevisionNote: Re-released for DXP Platform.; Publisher: Altium Limited
Q1-Q5 = CSD17577Q3A: N-Channel 30V 35A _Ta_ 2.8W _Ta_, 53W _Tc_ Surface Mount 8-VSONP _3x3.15_; MF: Texas Instruments; MP: CSD17577Q3A; SnapEDA_Link: https://www.snapeda.com/parts/CSD17577Q3A/Texas%20Instruments/view-part/486367/?ref=snap; Availability: Unavailable; Package: VSON-8 Texas Instruments; Value: *; Price: None
R2 R4 R9-R15 R21 R24-R27 R29-R31 R33-R41 R46-R56 R59-R65 R67 R69-R72 R75-R80 R82-R85 R95 R97 R99 R100 R109 R111 = Resistor: Published: 8-Jun-2000; LatestRevisionDate: 17-Jul-2002; LatestRevisionNote: Re-released for DXP Platform.; PackageReference: AXIAL-0.3; Publisher: Altium Limited
R3 R5 R16 R17 R28 R32 R42-R45 R57 R58 R66 R68 R73 R74 R86-R89 R?#1-R?#3 = Resistor: RES SMD 4.7K OHM 1% 1/10W 0805; PACKAGE: SMD0805; STOCK CODE: RM10JTN472; SUPPLIER: tme.vn; TYPE: SMD; STOCK DESC: 4.7K 5% SMD-0805 Resistor; UNIT PRICE: 60
RL1-RL10 = Relay 1: Relay SPDT,10A - 12VDC 5 Pin; Value: Relay SPDT, 10A, 12V
U = PCA9685PW: LED Driver IC 16 Output Linear PWM Dimming 25mA 28-TSSOP; MF: NXP USA; SnapEDA_Link: https://www.snapeda.com/parts/PCA9685PW/NXP%20USA%20Inc./view-part/4219090/?ref=snap; MP: PCA9685PW; Availability: Unavailable; Package: TSSOP-28 NXP USA; Price: None; Value: *
U1 U2 = ULN2003: IC PWR RELAY 7NPN 1:1 16SOIC; BRAND: Texas Instruments; PACKAGE: SOIC-16; PART NO: ULN2003AD; STOCK CODE: ULN2003AD; SUPPLIER: tme.vn; TYPE: SMD; STOCK DESC: TRANS 7 NPN DARL 50V 500MA 16SO; UNIT PRICE: 5000
R6-R8 R81 R108 = Resistor2: Manufacturer: *; Manufacturer Part No: *; Component Type: Resistor; Supplier: *; Order Code: *